# Altium project Tyri_light.PrjPcb
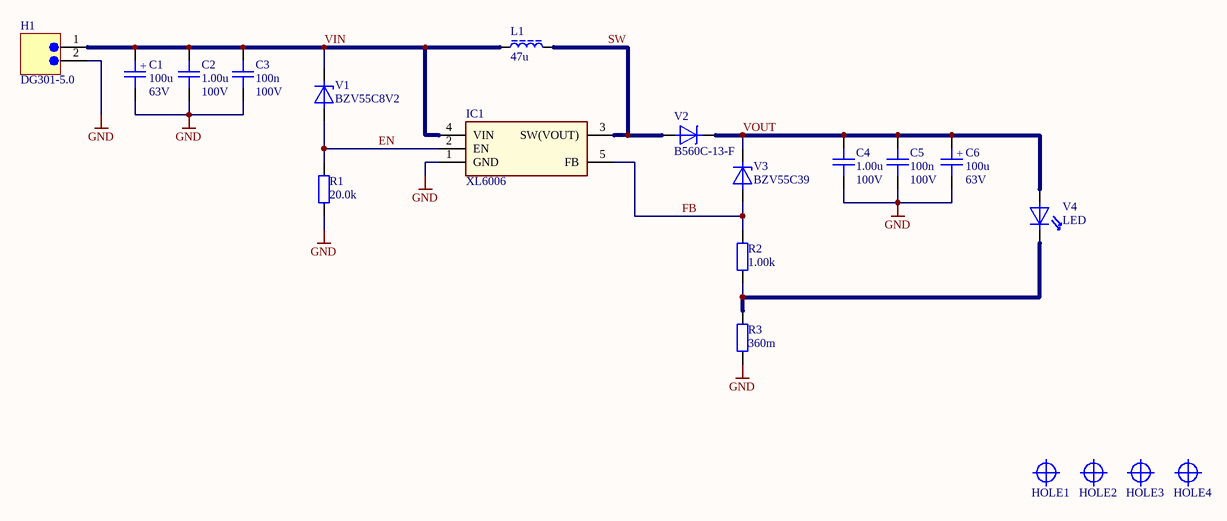
[diagram p0: led_supply.SchDoc]
BOM_title: Tyri light PSU for 20/30W LED; PCB_approved: Jenda st.; PCB_author: Jenda ml.; PCB_checked: Jenda ml.; PCB_title: Tyri light PSU for 20/30W LED; SCH_approved: Jenda st.; SCH_author: Jenda ml.; SCH_checked: Jenda ml.; SCH_title: Tyri light PSU for 20/30W LED
1 sheet, 20 parts. Net scope: global (net labels, ports and power ports of the same name join across sheets).
Board file: led_supply.PcbDoc

## Sheet led_supply.SchDoc
size 297 x 209 mm; CompanyName: Regional Innovation Centre for Electrical Engineering; Organization: RICE; Address1: Univerzitni 26; Address2: 306 14 Plzen; Address3: Czech Republic; Revision: A; SheetNumber: 1; SheetTotal: 1; ProjectName: [PROJECT NAME]

### Parts
C1  Voltage: 63V  [sm_cap_elyt10m]  (hidden comment: 100u)
C2  Voltage: 100V  [sm_cap_1206]  (hidden comment: 1.00u)
C3  Voltage: 100V  [sm_cap_1206]  (hidden comment: 100n)
C4  Voltage: 100V  [sm_cap_1206]  (hidden comment: 1.00u)
C5  Voltage: 100V  [sm_cap_1206]  (hidden comment: 100n)
C6  Voltage: 63V  [sm_cap_elyt10m]  (hidden comment: 100u)
H1  DG301-5.0  [TH_CON_2PIN_PIT197]
HOLE1  HOLE_30  [th_mch_hole30m]  (value not drawn)  (no BOM)
HOLE2  HOLE_30  [th_mch_hole30m]  (value not drawn)  (no BOM)
HOLE3  HOLE_30  [th_mch_hole30m]  (value not drawn)  (no BOM)
HOLE4  HOLE_30  [th_mch_hole30m]  (value not drawn)  (no BOM)
IC1  XL6006  [XL6006]
L1  47u  [sm_ind_SRP1270]
R1  20.0k  [sm_res_0805]
R2  1.00k  [sm_res_0805]
R3  360m  [SM_RES_2512]
V1  BZV55C8V2  [sm_dio_minimelf_d59_l140]
V2  B560C-13-F  [sm_dio_smc]
V3  BZV55C39  [sm_dio_minimelf_d59_l140]
V4  LED  [PWR_LED]

### Nets
GND: C1.2 C2.1 C3.1 C4.1 C5.1 C6.2 H1.2 IC1.1(GND) R1.1 R3.1
EN: IC1.2(EN) R1.2 V1.1(A)
FB: IC1.5(FB) R2.2 V3.1(A)
SW: IC1.3(SW(VOUT)) L1.2 V2.1(A)
VIN: C1.1 C2.2 C3.2 H1.1 IC1.4(VIN) L1.1 V1.2(C)
VOUT: C4.2 C5.2 C6.1 V2.2(C) V3.2(C) V4.1(+)
NetR2_1: R2.1 R3.2 V4.2(-)

### Notes on the sheet
- Size:
- A4
- Date:
- Title:
- Author:
- Checked by:
- Type:
- Subtitle:
- Nr.:
- Variant:
- Revision:
- Sheet
- of
- Approved by:
- File:
- Note: Data in fields enter via project/document parameters.
- (in symbol CAP_000411) +

### Library data of the parts
C1 C6 = CAP_000411: CAP ELYT 47u 50V low ESR 10mm; Part Select: SCAP0003000700002470; Part Category: Electrolytic/G; ManufacturerID: Panasonic; Manuf Part Number: EEE-FC1H470P; PartQuantity: 1; Supp Part number: PCE4020CT-ND; LastRevisionNote: new release; Tolerance: 20%; Cat1: Electrolytic; Cat2: G; Min Oper Temperature: -40; Max Oper Temperature: 105; PCB Status: Electrical; ID: 2290; Preference: -1000; Marking: 47HFC; FIT: 2; Designer: Jiri  Cengery; Exact price 2: 0; Published: 11.5.2011; Publisher: Libor Polacek; LastRevisionDate: 11.5.2011; Value: 100u; Part Number: CAP_000411; PartNumber: CAP_000411; Dielectric: elyt; Part type: CAP; RoHS: 1; SupplierID: Digikey; Price: 19; Exact price: 1; ComponentLink1Description: Datasheet; ComponentLink1URL: https://riceproject.fel.zcu.cz/Altium/PDF/Passive/Capacitors/panasonic_FC.pdf; Stock: 21; Active: 1; Alternative: 1; Manufacturer: Panasonic; ManufacturerURL: http://www.industrial.panasonic.com/; Supplier: Digikey; SupplierURL: http://www.digikey.com/; SupplierID2: no supplier; Supplier2: N/A; SupplierURL2: N/A; SupplierID3: no supplier; Supplier3: N/A; SupplierURL3: N/A; Price 2: 0; Price 3: 0; Exact price 3: 0
C2 C4 = CAP_000356: CAP CER 1.00u 100V X7R 10% 1206; Part Select: SCAP0001000500027100; Part Category: Ceramic/1206/X7R; ManufacturerID: TDK; Manuf Part Number: C3216X7R2A105K; PartQuantity: 1; Supp Part number: 445-4467-2-ND; Manufacturer: TDK Corporation; LastRevisionNote: new release; Cat1: Ceramic; Cat2: 1206; Min Oper Temperature: -55; Max Oper Temperature: 125; PCB Status: Electrical; ID: 360; FIT: 0,100000001490116; Designer: MaJa; Published: 11.5.2011; Publisher: Libor Polacek; LastRevisionDate: 11.5.2011; Value: 1.00u; Part Number: CAP_000356; PartNumber: CAP_000356; Tolerance: 10%; Dielectric: X7R; Part type: CAP; Cat3: X7R; RoHS: 1; Quantity: 1; SupplierID: Digikey; Price: 2,24207997322083; Exact price: 1; ComponentLink1Description: Datasheet; ComponentLink1URL: https://riceproject.fel.zcu.cz/Altium/PDF/passive/capacitors/Cxxxx_TDK_100V.pdf; Stock: 9; Active: 1; Alternative: 1; ManufacturerURL: http://www.tdk.com/; Supplier: Digikey; SupplierURL: http://www.digikey.com/; SupplierID2: no supplier; Supplier2: N/A; SupplierURL2: N/A; SupplierID3: no supplier; Supplier3: N/A; SupplierURL3: N/A; Price 2: 0; Price 3: 0
C3 C5 = CAP_000351: CAP CER 100n 100V X7R 10% 1206; Part Select: SCAP0001000500026100; Part Category: Ceramic/1206/X7R; ManufacturerID: AVX; Manuf Part Number: 12061C104KAT2A; PartQuantity: 1; Supp Part number: 478-1529-2-ND; LastRevisionNote: new release; Cat1: Ceramic; Cat2: 1206; Min Oper Temperature: -55; Max Oper Temperature: 125; PCB Status: Electrical; ID: 355; FIT: 0,100000001490116; Designer: MaJa; Published: 11.5.2011; Publisher: Libor Polacek; LastRevisionDate: 11.5.2011; Value: 100n; Part Number: CAP_000351; PartNumber: CAP_000351; Tolerance: 10%; Dielectric: X7R; Part type: CAP; Cat3: X7R; RoHS: 1; Quantity: 1; SupplierID: Digikey; Price: 0,62279999256134; Exact price: 1; ComponentLink1Description: Datasheet; ComponentLink1URL: https://riceproject.fel.zcu.cz/Altium/PDF/passive/capacitors/xxxxC_AVX.pdf; Stock: 0; Active: 1; Alternative: 1; Manufacturer: AVX; ManufacturerURL: http://www.avx.com/; Supplier: Digikey; SupplierURL: http://www.digikey.com/; SupplierID2: no supplier; Supplier2: N/A; SupplierURL2: N/A; SupplierID3: no supplier; Supplier3: N/A; SupplierURL3: N/A; Price 2: 0; Price 3: 0
H1 = CON_000079: CON 2pin power 197mill; Part Select: TCON0004000000001500; ManufacturerID: DEGSON; Manuf Part Number: DG301-5.0-02P-12; PartQuantity: 1; Supp Part number: DG301-5.0-2P12; LastRevisionNote: Initial version; Min Oper Temperature: -30; Max Oper Temperature: 120; PCB Status: Electrical; ID: 1796; Designer: Tomáš Košan; LastRevisionDate: 15.6.2011; Publisher: Turjanica; Published: 15.6.2011; Value: DG301-5.0; Part Number: CON_000079; PartNumber: CON_000079; Pin: 2; Part type: CON; Cat1: Power; RoHS: 1; Part Category: Power; SupplierID: TME; Price: 3,84999990463257; Exact price: 1; ComponentLink1Description: Datasheet; ComponentLink1URL: https://riceproject.fel.zcu.cz/Altium/PDF/Passive/Connectors/dg301-5.0.pdf; Stock: 0; Active: 1; Alternative: 1; Manufacturer: DEGSON; ManufacturerURL: http://www.degson.com/; Supplier: TME; SupplierURL: http://www.tme.eu/cz/; SupplierID2: no supplier; Supplier2: N/A; SupplierURL2: N/A; SupplierID3: no supplier; Supplier3: N/A; SupplierURL3: N/A; Price 2: 0; Price 3: 0
HOLE1-HOLE4 = MCH_000055: MCH test hole 3mm no pad; Part Select: TMCH0002000400000000; Part Category: Virtual/Mounting holes; ManufacturerID: no manufacturer; Manuf Part Number: x; PartQuantity: 1; LastRevisionNote: new release; Cat1: Virtual; Cat2: Mounting holes; Min Oper Temperature: -60; Max Oper Temperature: 200; ID: 2632; Exact price: 0; Designer: Jiri Cengery; Publishied: 8.11.2013; Publisher: Jiri Svarny; LastRevisionDate: 8.11.2013; Value: HOLE_30; Part Number: MCH_000055; PartNumber: MCH_000055; Function Type: hole; Part type: MCH; RoHS: 1; PCB Status: Virtual; SupplierID: no supplier; Supp Part number: x; Price: 0; ComponentLink1Description: Datasheet; Preference: 0; Stock: 0; FIT: 0; Active: 1; Alternative: 1; Supplier: N/A; SupplierURL: N/A; SupplierID2: no supplier; Supplier2: N/A; SupplierURL2: N/A; SupplierID3: no supplier; Supplier3: N/A; SupplierURL3: N/A; Price 2: 0; Price 3: 0; Exact price 2: 0; Exact price 3: 0
IC1 = XL6006: 180KHz 60V 5A Switching Current Boost LED Constant Current Driver; Manufacturer_Name: Xlsemi; Datasheet Link: http://www.xlsemi.net/datasheet/XL6006%20datasheet-English.pdf; Manufacturer_Part_Number: XL6006
L1 = IND_000080: IND 47u 5A 13.7x13.7mm ferrite; Part Select: SIND0001000100005220; Part Category: Shielded/Standard; ManufacturerID: Bourns; Manuf Part Number: SRP1270-5R6M; PartQuantity: 1; Supp Part number: SRP1270-5R6MDKR-ND; Manufacturer: Bourns Inc.; LasrRevisionNote: new release; Tolerance: 20%; DC Current: 14A; Resistance: 10m; Cat1: Shielded; Cat2: Standard; Min Oper Temperature: -55; Max Oper Temperature: 125; PCB Status: Electrical; ID: 4984; FIT: 0,100000001490116; Designer: Jiri Svarny; Exact price 2: 0; Publishied: 11.5.2011; Publisher: Libor Polacek; LastRevisionDate: 11.5.2011; Value: 47u; Part Number: IND_000080; PartNumber: IND_000080; Part type: IND; RoHS: 1; SupplierID: Digikey; Price: 30,5; Exact price: 1; ComponentLink1Description: Datasheet; ComponentLink1URL: https://riceproject.fel.zcu.cz/Altium/PDF/Passive/Inductors/SRP1270_Bourns.pdf; Preference: 1; Stock: 0; Active: 1; Alternative: 1; ManufacturerURL: http://www.bourns.com; Supplier: Digikey; SupplierURL: http://www.digikey.com/; SupplierID2: no supplier; Supplier2: N/A; SupplierURL2: N/A; SupplierID3: no supplier; Supplier3: N/A; SupplierURL3: N/A; Price 2: 0; Price 3: 0; Exact price 3: 0
R1 = RES_000274: RES 0805 20.0k 1% 100ppm SMD thick film; Part Select: SRES0001000400005200; Part Category: Thick film/0805; ManufacturerID: Panasonic; Manuf Part Number: ERJ6ENF2002V; PartQuantity: 1; Supp Part number: P20.0kCTR-ND; LastRevisionNote: new release; Power: 125mW; Cat2: 0805; Min Oper Temperature: -55; Max Oper Temperature: 125; PCB Status: Electrical; ID: 635; Preference: 0; FIT: 0,100000001490116; Designer: Kamil Kosturik; Published: 11.5.2011; Publisher: Libor Polacek; LastRevisionDate: 11.5.2011; Value: 20.0k; Part Number: RES_000274; PartNumber: RES_000274; Tolerance: 1%; Thermal Stability: 100ppm; Part type: RES; Cat1: Thick film; RoHS: 1; Quantity: 1; SupplierID: Digikey; Price: 0,0900000035762787; Exact price: 1; ComponentLink1Description: Datasheet; ComponentLink1URL: https://riceproject.fel.zcu.cz/Altium/PDF/passive/resistors/ERJ_EKF_Panasonic.pdf; Stock: 70; Active: 1; Alternative: 1; Manufacturer: Panasonic; ManufacturerURL: http://www.industrial.panasonic.com/; Supplier: Digikey; SupplierURL: http://www.digikey.com/; SupplierID2: no supplier; Supplier2: N/A; SupplierURL2: N/A; SupplierID3: no supplier; Supplier3: N/A; SupplierURL3: N/A; Price 2: 0; Price 3: 0; Exact price 2: 0; Exact price 3: 0
R2 = RES_000243: RES 0805 1.00k 1% 100ppm SMD thick film; Part Select: SRES0001000400004100; Part Category: Thick film/0805; ManufacturerID: Panasonic; Manuf Part Number: ERJ6ENF1001V; PartQuantity: 1; Supp Part number: P1.00kCTR-ND; Supp Part number 2: 667-ERJ-6ENF1001V; LastRevisionNote: new release; Power: 125mW; Cat2: 0805; Min Oper Temperature: -55; Max Oper Temperature: 125; PCB Status: Electrical; ID: 604; Preference: 0; FIT: 0,100000001490116; Designer: Tomáš Košan; Published: 11.5.2011; Publisher: Libor Polacek; LastRevisionDate: 11.5.2011; Value: 1.00k; Part Number: RES_000243; PartNumber: RES_000243; Tolerance: 1%; Thermal Stability: 100ppm; Part type: RES; Cat1: Thick film; RoHS: 1; Quantity: 1; SupplierID: Digikey; Price: 0,0900000035762787; Exact price: 1; ComponentLink1Description: Datasheet; ComponentLink1URL: https://riceproject.fel.zcu.cz/Altium/PDF/passive/resistors/ERJ_EKF_Panasonic.pdf; Stock: 1225; Active: 1; Alternative: 1; Manufacturer: Panasonic; ManufacturerURL: http://www.industrial.panasonic.com/; Supplier: Digikey; SupplierURL: http://www.digikey.com/; SupplierID2: Mouser; Supplier2: Mouser Electronics; SupplierURL2: http://www.mouser.com; SupplierID3: no supplier; Supplier3: N/A; SupplierURL3: N/A; Price 2: 2,4300000667572; Price 3: 0; Exact price 2: 0; Exact price 3: 0
R3 = RES_000543: RES 2512 0.0R 1.5W SMD thick film; Part Select: SRES0001001000000000; Part Category: Thick film/2512; ManufacturerID: Vishay; Manuf Part Number: CRCW25120000Z0EGHP; PartQuantity: 1; Supp Part number: 541-0.0RBCT-ND; LastRevisionNote: new release; Tolerance: 1%; Power: 2W; Thermal Stability: 100ppm; Cat2: 2512; Min Oper Temperature: -55; Max Oper Temperature: 125; PCB Status: Electrical; ID: 1743; Exact price: 0; Designer: Jiri  Cengery; Published: 11.5.2011; Publisher: Libor Polacek; LastRevisionDate: 11.5.2011; Value: 360m; Part Number: RES_000543; PartNumber: RES_000543; Part type: RES; Cat1: Thick film; RoHS: 1; SupplierID: Digikey; Price: 16; ComponentLink1Description: Datasheet; ComponentLink1URL: https://riceproject.fel.zcu.cz/Altium/PDF/passive/resistors/Resistor_Vishay.pdf; Preference: 0; Stock: 0; Marking: 0; FIT: 1; Active: 1; Alternative: 1; Manufacturer: Vishay; ManufacturerURL: http://www.vishay.com/; Supplier: Digikey; SupplierURL: http://www.digikey.com/; SupplierID2: no supplier; Supplier2: N/A; SupplierURL2: N/A; SupplierID3: no supplier; Supplier3: N/A; SupplierURL3: N/A; Price 2: 0; Price 3: 0
V1 V3 = DIO_000033: DIO Diode zener 8V2; 500mW; miniMELF; Part Select: SDIO0003000000000000; ManufacturerID: Micro Commercial; Manuf Part Number: BZV55C8V2-TP; PartQuantity: 1; Supp Part number: BZV55C8V2-TPMSCT-ND; Manufacturer: Micro Commercial Components Corp.; LastRevisionNote: new release; Voltage: 8.2V; Min Oper Temperature: -55; Max Oper Temperature: 150; PCB Status: Electrical; ID: 2320; Preference: 0; FIT: 2; Designer: Jiri Cengery; Published: 11.5.2011; Publisher: Libor Polacek; LastRevisionDate: 11.5.2011; Part Number: DIO_000033; PartNumber: DIO_000033; Part type: DIO; Cat1: Zener; RoHS: 1; Part Category: Zener; SupplierID: Digikey; Price: 3,1800000667572; Exact price: 1; ComponentLink1Description: Datasheet; ComponentLink1URL: https://riceproject.fel.zcu.cz/Altium/PDF/Semiconductor/Analog/Diode/Zener/BZV55C_MicroCommercial.pdf; Stock: 44; Active: 1; Alternative: 1; ManufacturerURL: http://mccsemi.com; Supplier: Digikey; SupplierURL: http://www.digikey.com/; SupplierID2: no supplier; Supplier2: N/A; SupplierURL2: N/A; SupplierID3: no supplier; Supplier3: N/A; SupplierURL3: N/A; Price 2: 0; Price 3: 0; Exact price 2: 0; Exact price 3: 0
  V1: Value: BZV55C8V2
  V3: Value: BZV55C39
V2 = DIO_000095: DIO Schottky 40V 5A SMC; Part Select: SDIO0002000000000000; ManufacturerID: DIODES incorporated; Manuf Part Number: B540C-13-F; PartQuantity: 1; Supp Part number: 1843671; LastRevisionNote: new release; Min Oper Temperature: -55; Max Oper Temperature: 150; PCB Status: Electrical; ID: 5170; Preference: 0; FIT: 2; Designer: Jiri  Cengery; Published: 11.5.2011; Publisher: Libor Polacek; LastRevisionDate: 11.5.2011; Value: B560C-13-F; Part Number: DIO_000095; PartNumber: DIO_000095; Voltage: 40V; Current: 5A; Part type: DIO; Cat1: Schottky; RoHS: 1; Part Category: Schottky; SupplierID: Farnell; Price: 13; Exact price: 1; ComponentLink1Description: Datasheet; ComponentLink1URL: https://riceproject.fel.zcu.cz/Altium/PDF/Semiconductor/Analog/Diode/2238476.pdf; Stock: 0; Active: 1; Alternative: 1; Manufacturer: DIODES incorporated; ManufacturerURL: http://www.diodes.com; Supplier: Farnell; SupplierURL: http://cz.farnell.com/; SupplierID2: no supplier; Supplier2: N/A; SupplierURL2: N/A; SupplierID3: no supplier; Supplier3: N/A; SupplierURL3: N/A; Price 2: 0; Price 3: 0; Exact price 2: 0; Exact price 3: 0
V4 = LED: Power LED 20 - 100W (40x42mm))

## Assembly variants
H1_off: not fitted H1